# EAGLE design level shifter v1.0 (EAGLE 6.2)
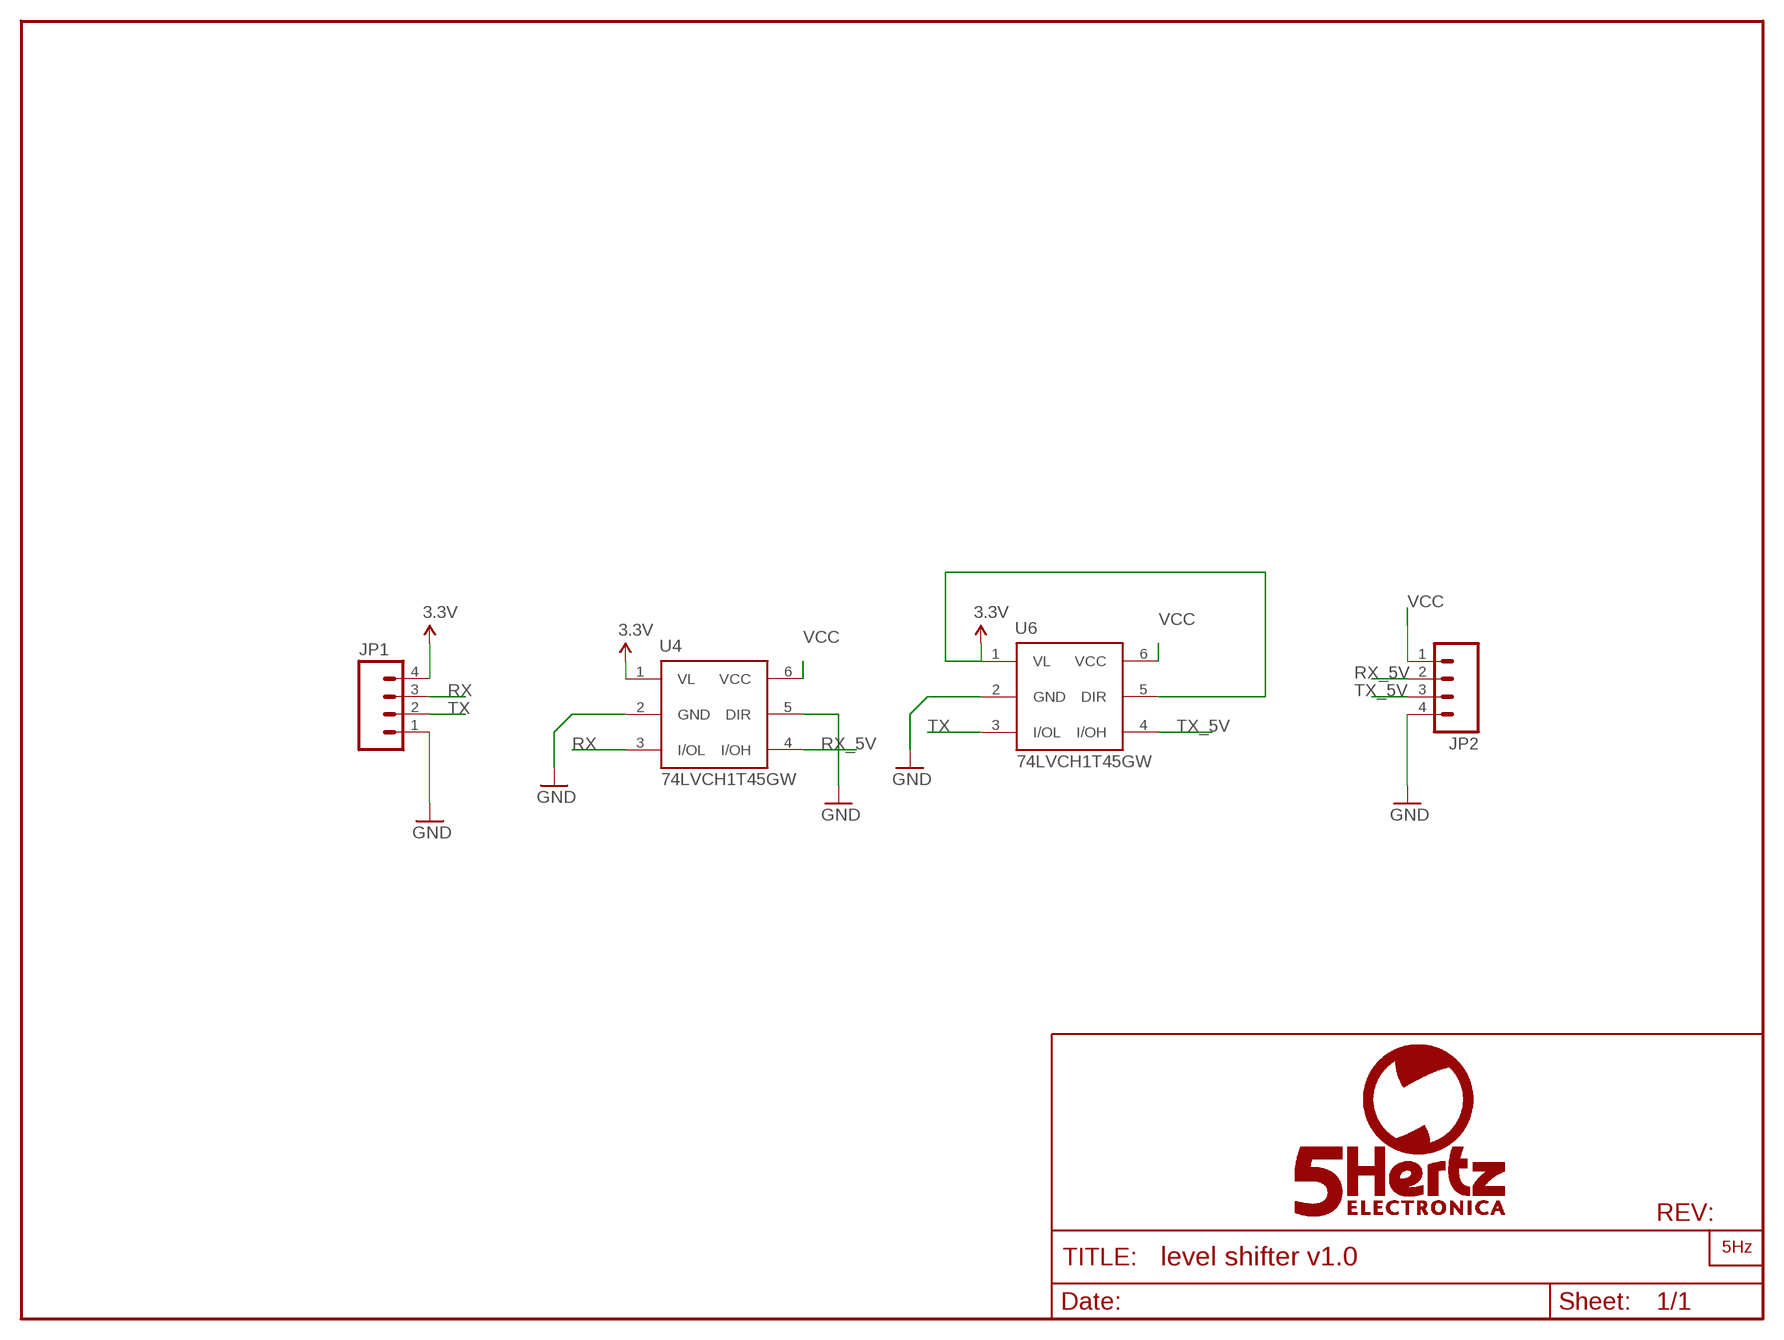
[diagram p0: schematic, sheet 1]

## Parts
JP1  M04PTH  [1X04]
JP2  M04PTH  [1X04]
U4  74LVCH1T45GW  [SOT-363]
U6  74LVCH1T45GW  [SOT-363]
U$1  LOGO_COPPER5MM  [LOGO_COP_5MM]

## Nets
3.3V: JP1.4 U4.1(VL) U6.1(VL) U6.5(DIR)
GND: JP1.1 JP2.4 U4.2(GND) U4.5(DIR) U6.2(GND)
RX: JP1.3 U4.3(I/OL)
RX_5V: JP2.2 U4.4(I/OH)
TX: JP1.2 U6.3(I/OL)
TX_5V: JP2.3 U6.4(I/OH)
VCC: JP2.1 U4.6(VCC) U6.6(VCC)

## Library data of the parts
JP1 JP2 = SparkFun:M04: Header 4 Standard 4-pin 0.1" header. Use with straight break away headers (SKU : PRT-00116), right angle break away headers (PRT-00553), swiss pins (PRT-00743), machine pins (PRT-00117), and female headers (PRT-00115). Molex polarized connector foot print use with SKU : PRT-08231 with associated crimp pins and housings. 1MM SMD Version SKU: PRT-10208
U4 U6 = 74LVCH1T45:74LVCH1T45GW
U$1 = LOGO:LOGO_COPPER

## Board
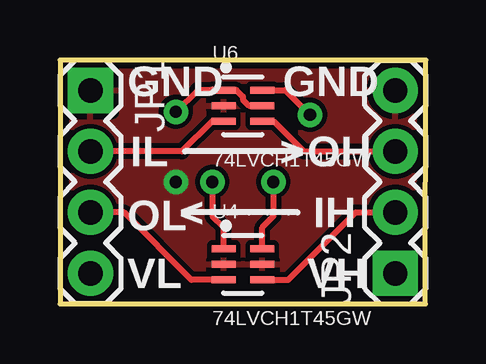
[diagram p1: board, top side]
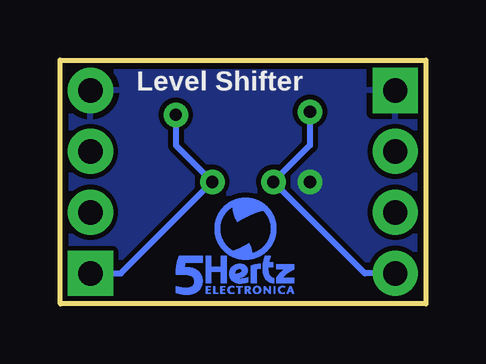
[diagram p2: board, bottom side, seen from below]

Size 15.24 x 10.16 mm. Coordinates in mm from the lower left corner, seen from the top.
Outline: 0,0 15.22,0 15.24,10.16 0,10.16 0,0
Copper layers (1*16): Top 0.035mm / dielectric 1.5mm / Bottom 0.035mm
Design rules: minimum track width 8mil, minimum drill 20mil, track to track 8mil, track to pad 8mil, pad to pad 8mil, via to via 8mil, smd to smd 8mil, copper to edge 10mil, drill to drill 8mil, minimum pad ring 12mil, minimum via ring 10mil, stop-mask expansion 4mil, vias tented up to drill 25mil, thermal gap 10mil

### Footprints (pad centres in the part's own frame; a part is rotated, then mirrored left to right if it is on the bottom)
1X04 = drill 1.016 pad 1.88 square: 1 0,0 | drill 1.016 pad 1.88: 2 2.54,0; 3 5.08,0; 4 7.62,0
SOT-363 = smd 0.3 x 0.99: 1 -0.65,-0.8; 2 0,-0.8; 3 0.65,-0.8; 4 0.65,0.81; 5 0,0.81; 6 -0.65,0.81

### Placement (x,y rotation side)
JP1  1.27,8.89 270 top
JP2  13.97,1.27 90 top
U4  7.62,1.65 270 top
U6  7.62,8.26 270 top
U$1  10.41,0.38 0 bottom

### Tracks (layer width: path | path; a pad name or v marks a point on that pad's centre or on a via)
3.3V  (via drill 0.51)
  Top 0.254: v6.35,5.08 6.35,3.66 6.82,3.19 U4.1 | 5.08,8.26 v4.83,8 5.73,8.9 U6.1 7.35,8.9 7.62,8.64 7.62,8.51 7.87,8.26 U6.5
  Bottom 0.254: JP1.4 2.54,1.27 v6.35,5.08 4.83,6.6 v4.83,8
GND  (via drill 0.51)
  other vias: 4.83,5.08
  pour Top: 0,0 0,10.16 15.24,10.16 15.24,0
  pour Bottom: 0,0 0,10.16 15.24,10.16 15.24,0
RX
  Top 0.254: U4.3 5.48,1 2.67,3.81 JP1.3
RX_5V
  Top 0.254: U4.4 9.51,1 12.32,3.81 JP2.2
TX
  Top 0.254: JP1.2 5.08,6.35 6.33,7.61 U6.3
TX_5V
  Top 0.254: JP2.3 10.16,6.35 8.9,7.61 U6.4
VCC  (via drill 0.51)
  Top 0.254: v8.89,5.08 8.89,3.65 8.43,3.19 U4.6 | U6.6 9.38,8.9 v10.41,7.87
  Bottom 0.254: JP2.1 12.7,1.27 v8.89,5.08 10.41,6.6 v10.41,7.87

### Text on the board
tPlace: GND | GND | IL | > | OH | OL | < | IH | VL | VH
bPlace: Level Shifter